# Altium schematic sheet Connectors.SchDoc: Set in Document Options » Parameters » Title
size Tabloid; Author: Set in Document Options » Parameters » Author + Contact info
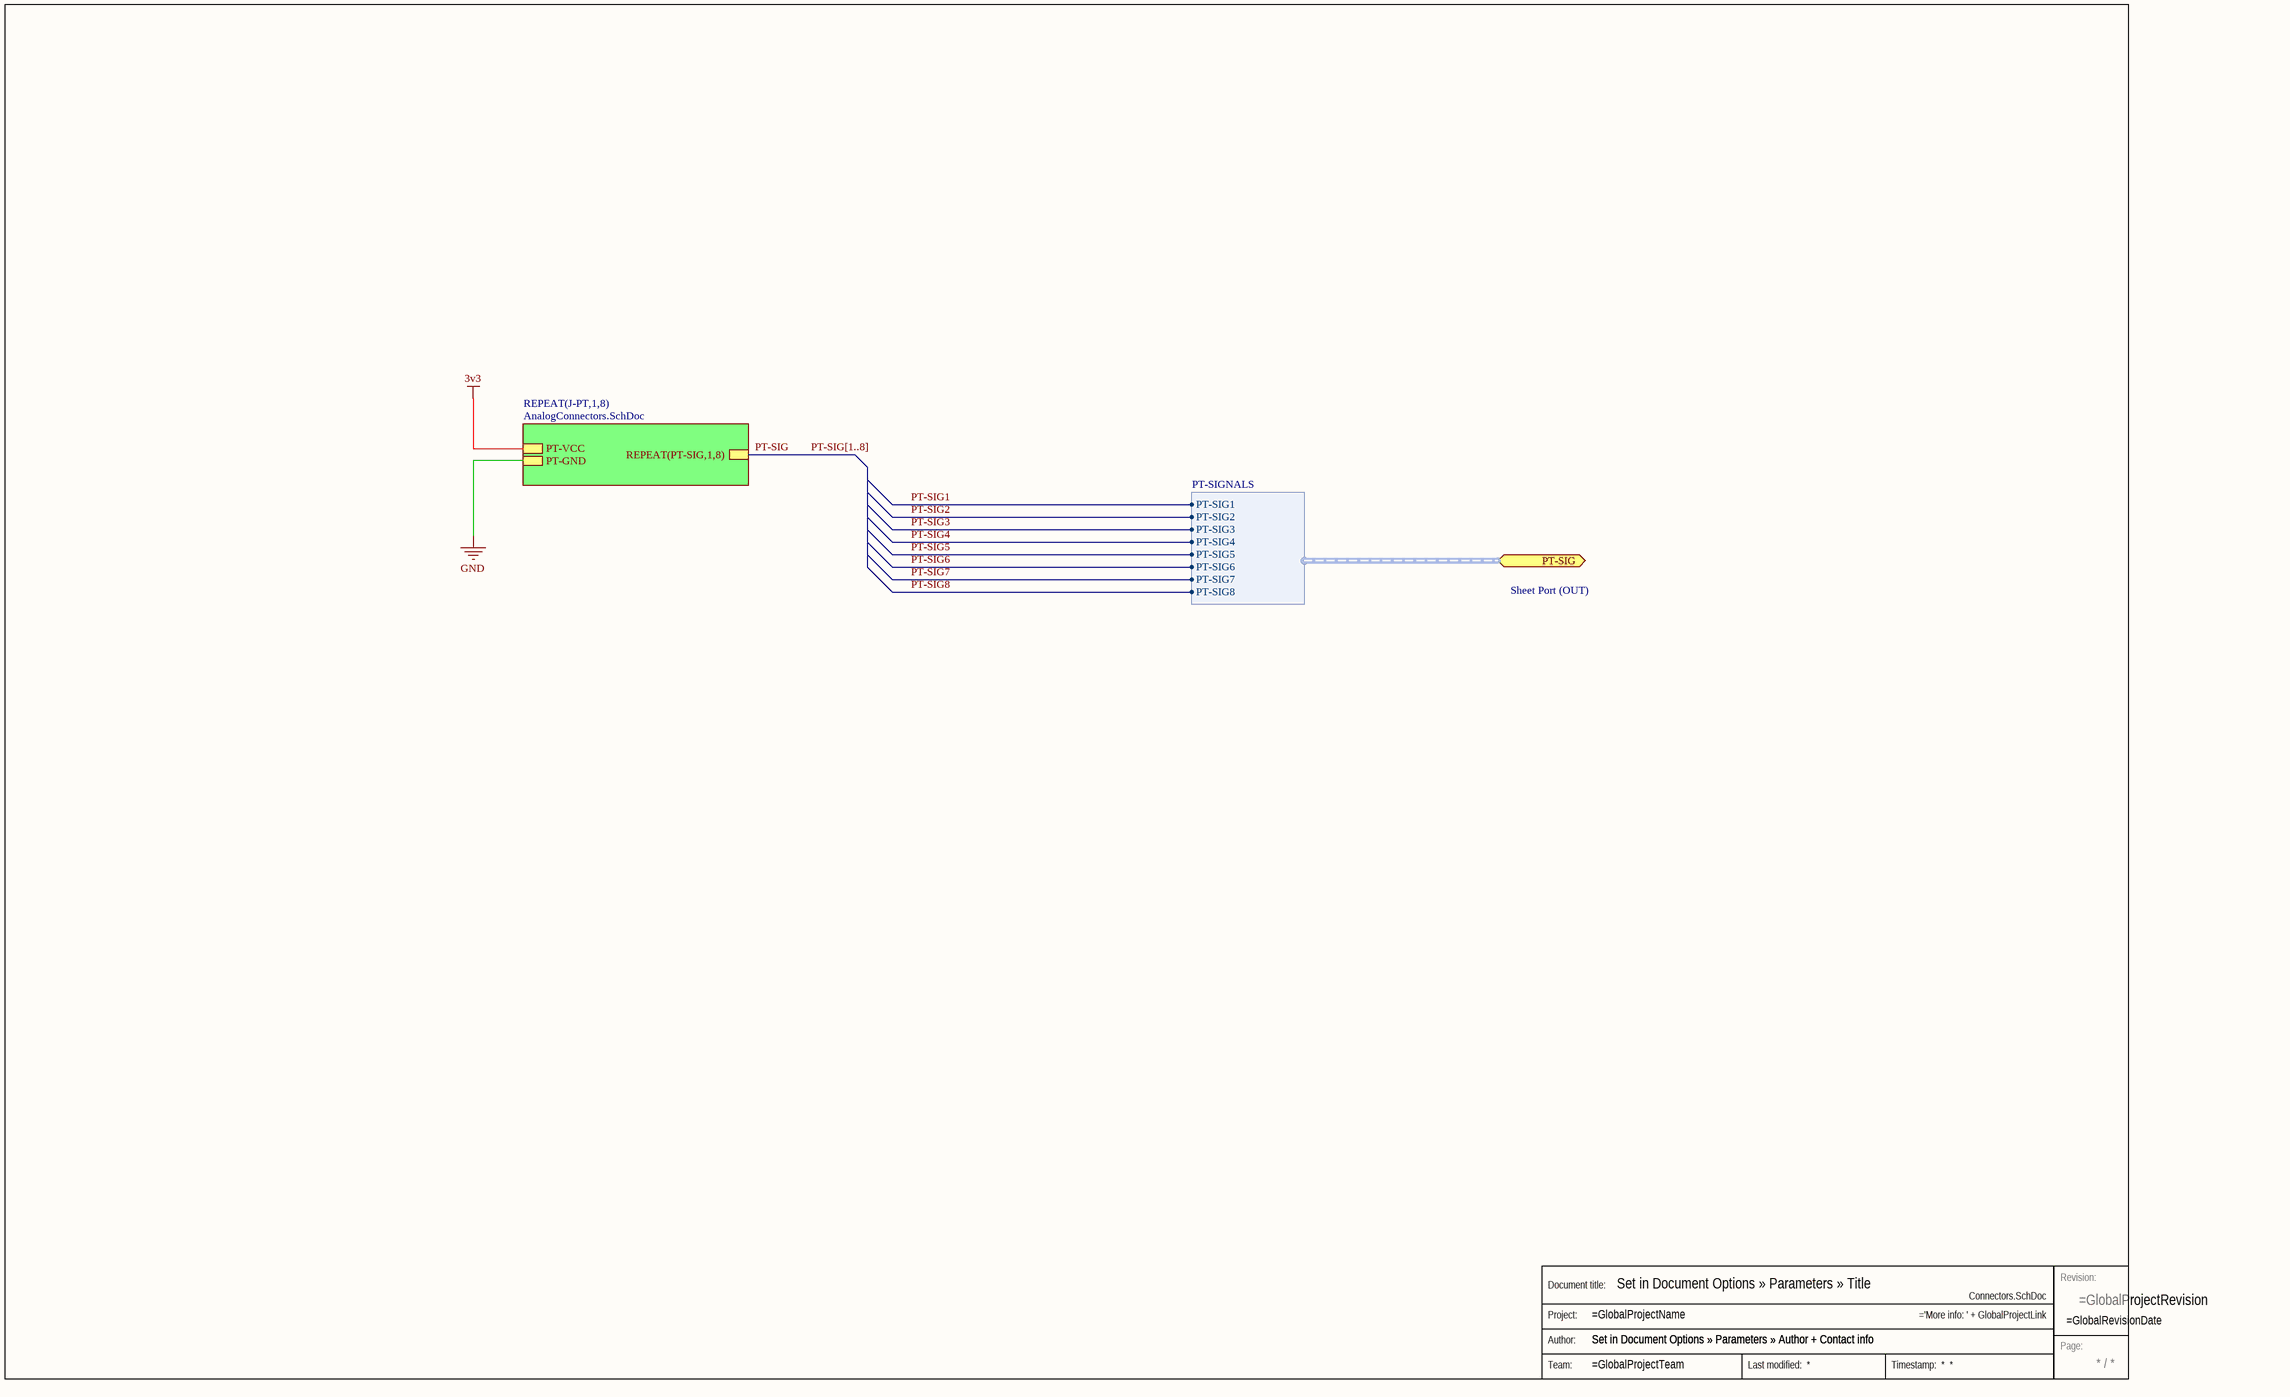
[diagram p0: Connectors.SchDoc]

## Parts
Stamp  Stamp  (value not drawn)  (graphical)

## Sub-sheets
REPEAT(J-PT,1,8) = AnalogConnectors.SchDoc: PT-VCC, REPEAT(PT-SIG,1,8), PT-GND

## Ports
PT-SIG (harness PT-SIGNALS)

## Harnesses
PT-SIGNALS: PT-SIG1, PT-SIG2, PT-SIG3, PT-SIG4, PT-SIG5, PT-SIG6, PT-SIG7, PT-SIG8

## Nets
3v3: sheet REPEAT(J-PT,1,8)/PT-VCC
GND: sheet REPEAT(J-PT,1,8)/PT-GND
PT-SIG: sheet REPEAT(J-PT,1,8)/REPEAT(PT-SIG,1,8)
PT-SIG1: port PT-SIG.PT-SIG1
PT-SIG2: port PT-SIG.PT-SIG2
PT-SIG3: port PT-SIG.PT-SIG3
PT-SIG4: port PT-SIG.PT-SIG4
PT-SIG5: port PT-SIG.PT-SIG5
PT-SIG6: port PT-SIG.PT-SIG6
PT-SIG7: port PT-SIG.PT-SIG7
PT-SIG8: port PT-SIG.PT-SIG8

## Buses and harness runs
bus PT-SIG[1..8]

## Notes on the sheet
- Sheet Port (OUT)
- (in symbol Stamp) Revision:; Document title:; Project:; Author:; Page:; Team: